# EAGLE schematic TakpadV3 (EAGLE 8.4.0)
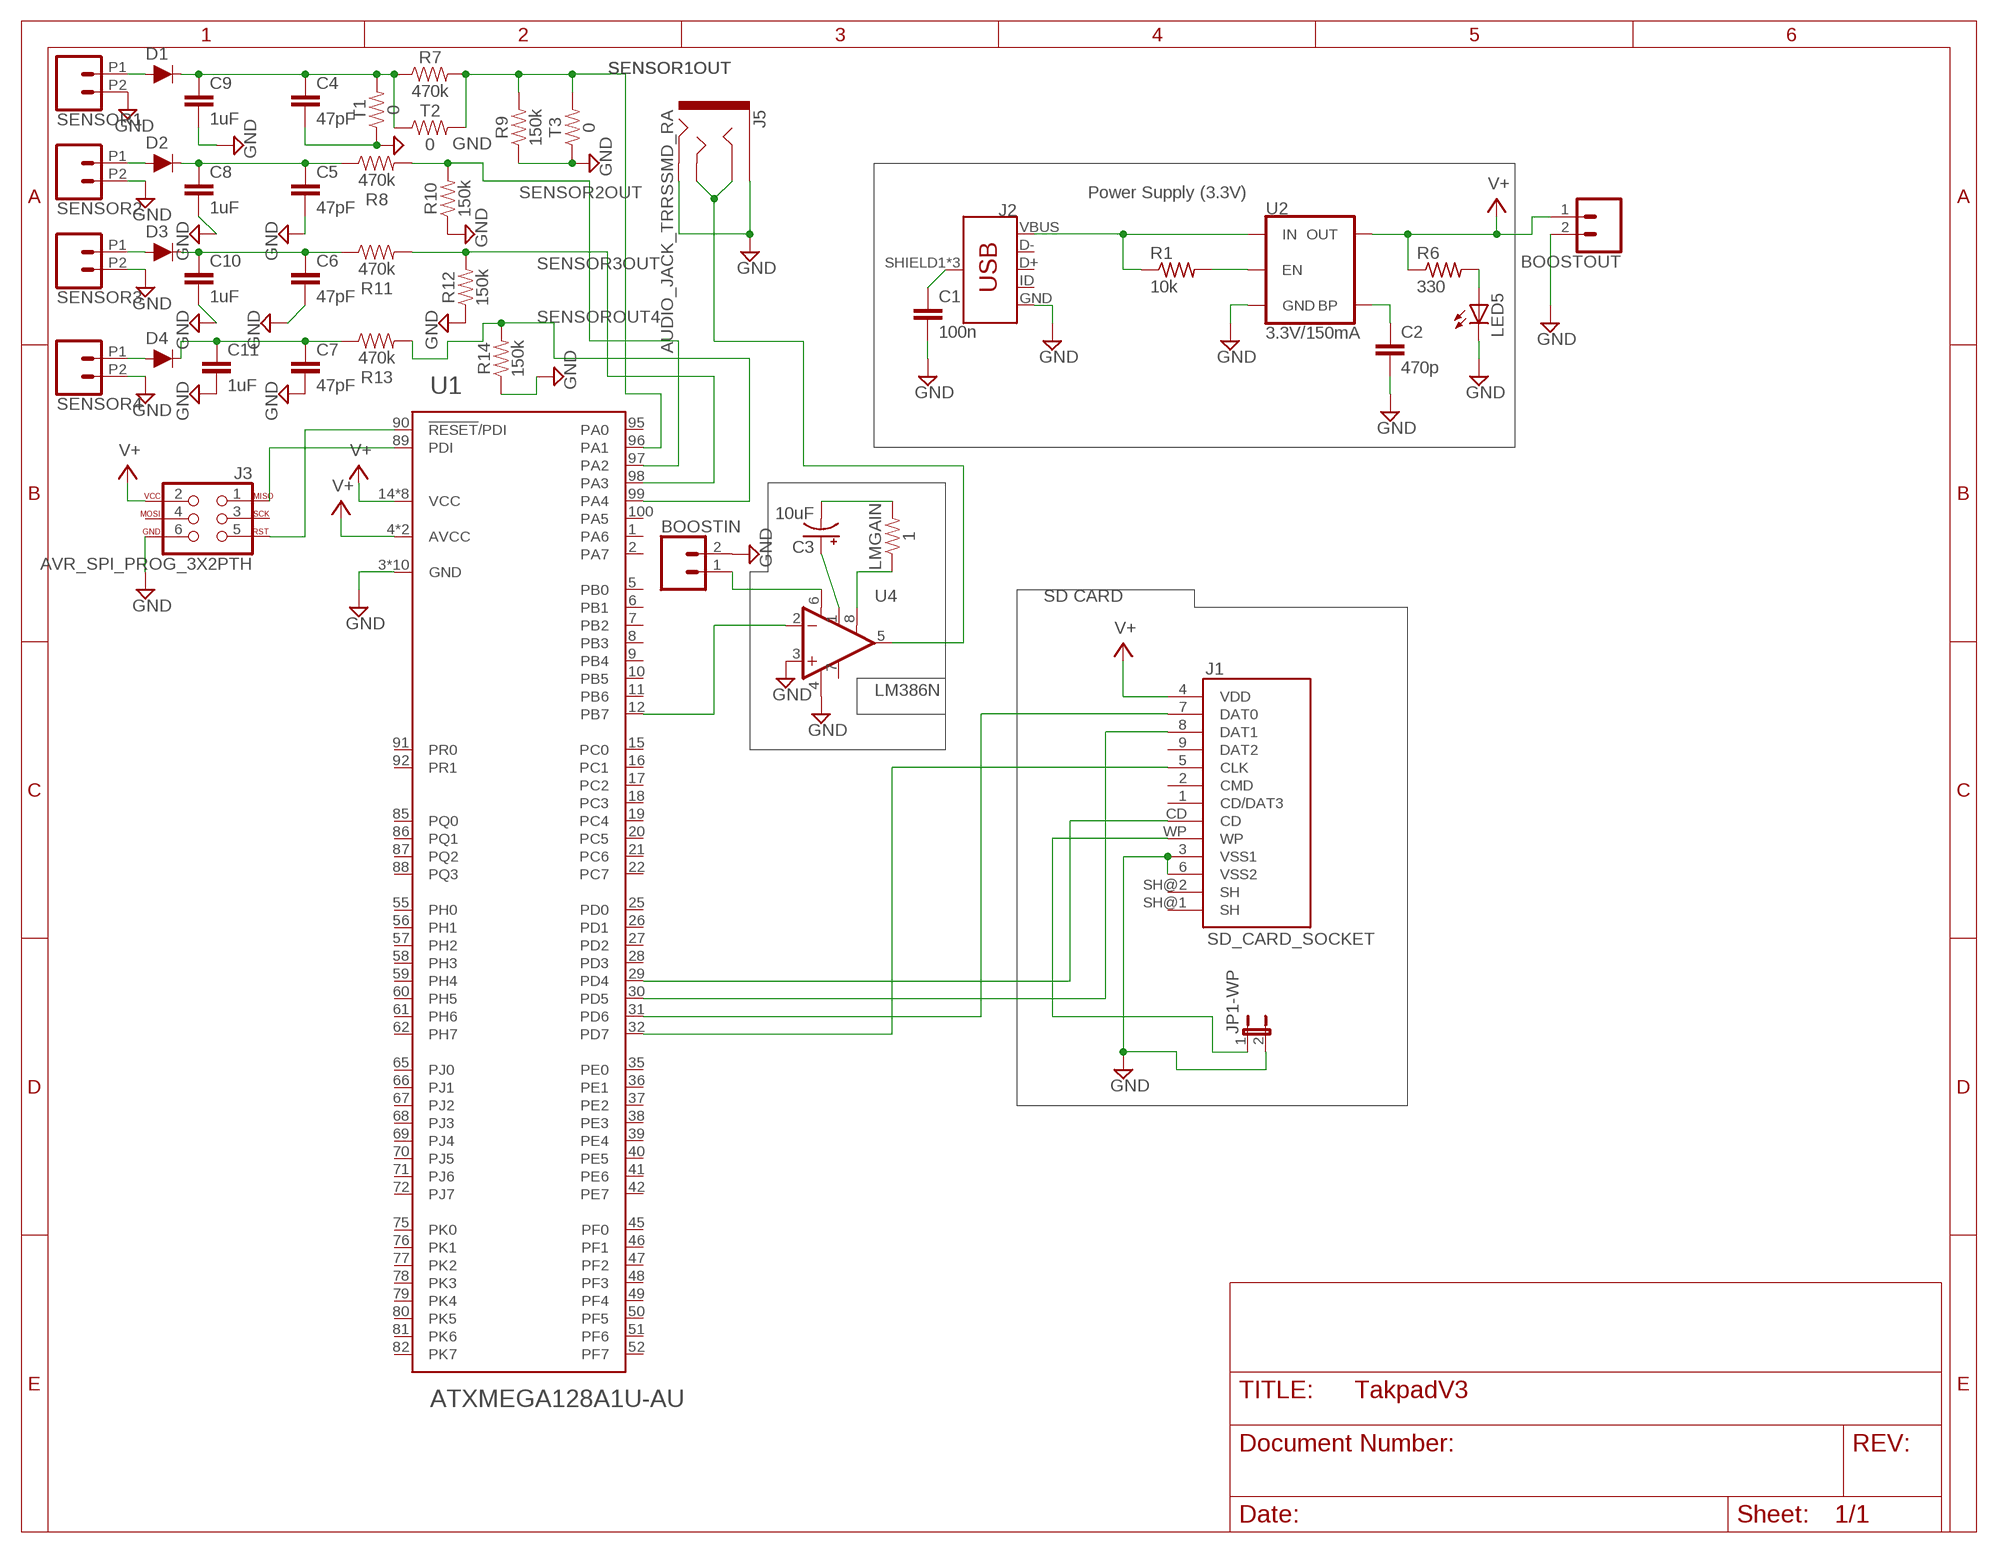
[diagram p0: schematic, sheet 1]

## Parts
BOOSTIN  CONN_02  [1X02]
BOOSTOUT  CONN_02  [1X02]
C1  100n  C-EUC1206  [C1206]
C2  470p  C-EUC1206  [C1206]
C3  10uF  10UF-POLAR-RADIAL-2.5MM-KIT-25V-20%  [CPOL-RADIAL-2.5MM-5MM-KIT]
C4  47pF  47PF-0603-50V-5%  [0603]
C5  47pF  47PF-0603-50V-5%  [0603]
C6  47pF  47PF-0603-50V-5%  [0603]
C7  47pF  47PF-0603-50V-5%  [0603]
C8  1uF  47PF-0603-50V-5%  [0603]
C9  1uF  47PF-0603-50V-5%  [0603]
C10  1uF  47PF-0603-50V-5%  [0603]
C11  1uF  47PF-0603-50V-5%  [0603]
D1  200mA/100V/1V  DIODE-1N4148  [DIODE-1N4148]
D2  200mA/100V/1V  DIODE-1N4148  [DIODE-1N4148]
D3  200mA/100V/1V  DIODE-1N4148  [DIODE-1N4148]
D4  200mA/100V/1V  DIODE-1N4148  [DIODE-1N4148]
J1  SD_CARD_SOCKET  [SD]
J2  USB_MICRO-B_FEMALE-SMT  [USB-B-MICRO-SMD]
J3  AVR_SPI_PROG_3X2PTH  [2X3]
J5  AUDIO_JACK_TRRSSMD_RA  [AUDIO_JACK_3.5MM_TRRS_SMD_RA]
JP1-WP  JUMPER-2PTH  [1X02]
LED5  LED10MM  [LED10MM]
LMGAIN  1  1OHM-0603-1/10W-1%  [0603]
R1  10k  R-US_M1206  [M1206]
R6  330  R-US_0204/7  [0204/7]
R7  470k  1KOHM-HORIZ-1/4W-1%  [AXIAL-0.3]
R8  470k  1KOHM-HORIZ-1/4W-1%  [AXIAL-0.3]
R9  150k  1KOHM-HORIZ-1/4W-1%  [AXIAL-0.3]
R10  150k  1KOHM-HORIZ-1/4W-1%  [AXIAL-0.3]
R11  470k  1KOHM-HORIZ-1/4W-1%  [AXIAL-0.3]
R12  150k  1KOHM-HORIZ-1/4W-1%  [AXIAL-0.3]
R13  470k  1KOHM-HORIZ-1/4W-1%  [AXIAL-0.3]
R14  150k  1KOHM-HORIZ-1/4W-1%  [AXIAL-0.3]
SENSOR1  CONN_022.54MM_SCREWTERM  [1X02_2.54_SCREWTERM]
SENSOR2  CONN_022.54MM_SCREWTERM  [1X02_2.54_SCREWTERM]
SENSOR3  CONN_022.54MM_SCREWTERM  [1X02_2.54_SCREWTERM]
SENSOR4  CONN_022.54MM_SCREWTERM  [1X02_2.54_SCREWTERM]
T1  0  1KOHM-HORIZ-1/4W-1%  [AXIAL-0.3]
T2  0  1KOHM-HORIZ-1/4W-1%  [AXIAL-0.3]
T3  0  1KOHM-HORIZ-1/4W-1%  [AXIAL-0.3]
U1  ATXMEGA128A1U-AU  [TQFP-100A-100]
U2  3.3V/150mA  V_REG_MIC52053.3V  [SOT23-5]
U4  LM386N  LM386  [DIP08]

## Nets
AUDIOINPUT: U1.12(PB7) U4.2(-IN)
AUDIOOUT: J5.RING1 J5.TIP U4.5(OUT)
BP: C2.1 U2.4(BP)
CD: J1.CD U1.29(PD4)
CLK: J1.5(CLK) U1.32(PD7)
DAT0: J1.7(DAT0) U1.31(PD6)
DAT1: J1.8(DAT1) U1.30(PD5)
EN: R1.2 U2.3(EN)
GND: BOOSTIN.2 BOOSTOUT.2 C1.2 C2.2 C4.2 C5.2 C6.2 C7.2 C8.2 C9.2 C10.2 C11.2 J1.3(VSS1) J1.6(VSS2) J2.GND J3.6 J5.EARTH J5.RING2 JP1-WP.2 LED5.K(C) R9.P$1 R10.P$1 R12.P$1 R14.P$1 SENSOR1.P2 SENSOR2.P2 SENSOR3.P2 SENSOR4.P2 T1.P$1 T3.P$1 U1.3(GND) U1.13(GND) U1.23(GND) U1.33(GND) U1.43(GND) U1.53(GND) U1.63(GND) U1.73(GND) U1.84(GND) U1.93(GND) U2.2(GND) U4.3(+IN) U4.4(V-)
LED: LED5.A R6.2
MISO: J3.1 U1.89(PDI)
N$9: C3.1(+) U4.1(GAIN)
N$10: C3.2(-) LMGAIN.2
N$11: LMGAIN.1 U4.8(GAIN)
RST: J3.5 U1.90(!RESET!/PDI)
SENSOR1: D1.A SENSOR1.P1
SENSOR1IN: C4.1 C9.1 D1.C R7.P$1 T1.P$2 T2.P$1
SENSOR1OUT: R7.P$2 R9.P$2 T2.P$2 T3.P$2 U1.96(PA1)
SENSOR2: D2.A SENSOR2.P1
SENSOR2IN: C5.1 C8.1 D2.C R8.P$1
SENSOR2OUT: R8.P$2 R10.P$2 U1.97(PA2)
SENSOR3: D3.A SENSOR3.P1
SENSOR3IN: C6.1 C10.1 D3.C R11.P$1
SENSOR3OUT: R11.P$2 R12.P$2 U1.98(PA3)
SENSOR4: D4.A SENSOR4.P1
SENSOR4IN: C7.1 C11.1 D4.C R13.P$1
SENSOROUT4: R13.P$2 R14.P$2 U1.99(PA4)
SHIELD: C1.1 J2.SHIELD1(SHIELD) J2.SHIELD2(SHIELD) J2.SHIELD3(SHIELD)
UPCONVERTERINPUT: BOOSTIN.1 U4.6(V+)
V+: BOOSTOUT.1 J1.4(VDD) J3.2 R6.1 U1.4(AVCC) U1.14(VCC) U1.24(VCC) U1.34(VCC) U1.44(VCC) U1.54(VCC) U1.64(VCC) U1.74(VCC) U1.83(VCC) U1.94(AVCC) U2.5(OUT)
VIN: J2.VBUS R1.1 U2.1(IN)
WP: J1.WP JP1-WP.1
Unconnected: J1.1(CD/DAT3) J1.2(CMD) J1.9(DAT2) J1.SH@1(SH) J1.SH@2(SH) J2.D+ J2.D- J2.ID J3.3 J3.4 U1.1(PA6) U1.2(PA7) U1.5(PB0) U1.6(PB1) U1.7(PB2) U1.8(PB3) U1.9(PB4) U1.10(PB5) U1.11(PB6) U1.15(PC0) U1.16(PC1) U1.17(PC2) U1.18(PC3) U1.19(PC4) U1.20(PC5) U1.21(PC6) U1.22(PC7) U1.25(PD0) U1.26(PD1) U1.27(PD2) U1.28(PD3) U1.35(PE0) U1.36(PE1) U1.37(PE2) U1.38(PE3) U1.39(PE4) U1.40(PE5) U1.41(PE6) U1.42(PE7) U1.45(PF0) U1.46(PF1) U1.47(PF2) U1.48(PF3) U1.49(PF4) U1.50(PF5) U1.51(PF6) U1.52(PF7) U1.55(PH0) U1.56(PH1) U1.57(PH2) U1.58(PH3) U1.59(PH4) U1.60(PH5) U1.61(PH6) U1.62(PH7) U1.65(PJ0) U1.66(PJ1) U1.67(PJ2) U1.68(PJ3) U1.69(PJ4) U1.70(PJ5) U1.71(PJ6) U1.72(PJ7) U1.75(PK0) U1.76(PK1) U1.77(PK2) U1.78(PK3) U1.79(PK4) U1.80(PK5) U1.81(PK6) U1.82(PK7) U1.85(PQ0) U1.86(PQ1) U1.87(PQ2) U1.88(PQ3) U1.91(PR0) U1.92(PR1) U1.95(PA0) U1.100(PA5) U4.7(BP)

## Notes on the sheet
- Power Supply (3.3V)
- SD CARD

## Library data of the parts
BOOSTIN BOOSTOUT SENSOR1-SENSOR4 = SparkFun-Connectors:CONN_02: Multi connection point. Often used as Generic Header-pin footprint for 0.1 inch spaced/style header connections On any of the 0.1 inch spaced packages, you can populate with these: Break Away Headers - Straight <https://www.sparkfun.com/products/116> (PRT-00116) Break Away Male Headers - Right Angle <https://www.sparkfun.com/products/553> (PRT-00553) Female Headers <https://www.sparkfun.com/products/115> (PRT-00115) Break Away Headers - Machine Pin <https://www.sparkfun.com/products/117> (PRT-00117) Break Away Female Headers - Swiss Machine Pin <https://www.sparkfun.com/products/743> (PRT-00743) For SCREWTERMINALS and SPRING TERMINALS visit here: Screw Terimnals on SparkFun.com <https://www.sparkfun.com/search/results?term=Screw+Terminals> (5mm/3.5mm/2.54mm spacing) This device is also useful as a general connection point to wire up your design to another part of your project. Our various solder wires solder well into these plated through hole pads. Hook-Up Wire - Assortment (Stranded, 22 AWG) <https://www.sparkfun.com/products/11375> (PRT-11375) Hook-Up Wire - Assortment (Solid Core, 22 AWG) <https://www.sparkfun.com/products/11367> (PRT-11367) View the entire wire category on our website here <https://www.sparkfun.com/categories/141> Special notes: Molex polarized connector foot print use with: PRT-08233 with associated crimp pins and housings. 2.54_SCREWTERM for use with PRT-10571. 3.5mm Screw Terminal footprints for PRT-08084 5mm Screw Terminal footprints for use with PRT-08432
C1 C2 = rcl:C-EU: CAPACITOR, European symbol
C3 = SparkFun-Capacitors:10UF-POLAR: 10.0µF polarized capacitors A capacitor is a passive two-terminal electrical component used to store electrical energy temporarily in an electric field.; PROD_ID: CAP-08440
C4-C7 = SparkFun-Capacitors:47PF: 47pF ceramic capacitors A capacitor is a passive two-terminal electrical component used to store electrical energy temporarily in an electric field.; PROD_ID: CAP-08913
C8-C11 = SparkFun-Capacitors:47PF: 47pF ceramic capacitors A capacitor is a passive two-terminal electrical component used to store electrical energy temporarily in an electric field.; PROD_ID: CAP-08913; VALUE: 47pF
D1-D4 = SparkFun-DiscreteSemi:DIODE: Diode These are standard reverse protection diodes and small signal diodes. SparkFun Products: SparkFun SparkPunk Sound Kit <https://www.sparkfun.com/products/11177> SparkFun ESP8266 Thing <https://www.sparkfun.com/products/13231>; PROD_ID: DIO-08378
J1 = SparkFun-Connectors:SD_CARD_SOCKET: SD Memory Card Connector (standard "large" size) Push-push normal type, CD enable, WP enable. Here is the connector we sell at SparkFun: SD/MMC Socket <https://www.sparkfun.com/products/12769> (PRT-12769) Datasheet <https://cdn.sparkfun.com/datasheets/Prototyping/19608.pdf> It is used on these SparkFun products: SparkFun SD/MMC Card Breakout <https://www.sparkfun.com/products/12941> (BOB-12941) SD Sniffer <https://www.sparkfun.com/products/11468> (TOL-11468); PROD_ID: CONN-11976; SF_ID: PRT-12769
J2 = SparkFun-Connectors:USB_MICRO-B: USB Type Micro-B Connector Male/female and PTH/SMT variants SparkFun Products: SparkFun microB USB Breakout <https://www.sparkfun.com/products/12035> SparkFun USB microB Plug Breakout <https://www.sparkfun.com/products/10031> SparkFun ESP8266 Thing <https://www.sparkfun.com/products/13231>; PROD_ID: CONN-11752
J3 = SparkFun-Connectors:AVR_SPI_PROG_3X2: AVR ISP 6 Pin This is the reduced ISP connector for AVR programming. Common on Arduino. This footprint will take up less PCB space and can be used with a 10-pin to 6-pin adapter such as SKU: BOB-08508 **Special note about "TEST_POINT" package. The stop mask is on the top side, so if you want your programming test points to be on the bottom of your board, make sure to place this package on the bottom side of the board. This also ensure that the orientation to program from the bottom side will be correct. SparkFun Products: SparkFun ISP Pogo Adapter <https://www.sparkfun.com/products/11591> - NS Tiny AVR Programmer <https://www.sparkfun.com/products/11801> -PTH
J5 = SparkFun-Connectors:AUDIO_JACK_TRRS: Audio Jack - 3.5mm TRRS (SMD) This is a 3.5mm TRRS SMD audio jack. TRRS connectors are the audio-style connectors that you see on some phones, MP3 players and development boards. TRRS stands for “tip, ring, ring, sleeve,” which reflects that this has three conductors and a ground. SparkFun Products: Audio Jack <https://www.sparkfun.com/products/12639> mbed Starter Kit <https://www.sparkfun.com/products/12968> SparkFun TRRS 3.5mm Jack Breakout <https://www.sparkfun.com/products/11570>; PROD_ID: CONN-10676; SF_ID: PRT-12639; SPICEPREFIX: E
JP1-WP = SparkFun-Retired:JUMPER-2: Jumper Basic 0.1" spaced jumper. Use with breakaway headers.
LED5 = led:LED: LED OSRAM: - CHIPLED LG R971, LG N971, LY N971, LG Q971, LY Q971, LO R971, LY R971 LH N974, LH R974 LS Q976, LO Q976, LY Q976 LO Q996 - Hyper CHIPLED LW Q18S LB Q993, LB Q99A, LB R99A - SideLED LS A670, LO A670, LY A670, LG A670, LP A670 LB A673, LV A673, LT A673, LW A673 LH A674 LY A675 LS A676, LA A676, LO A676, LY A676, LW A676 LS A679, LY A679, LG A679 - Hyper Micro SIDELED® LS Y876, LA Y876, LO Y876, LY Y876 LT Y87S - SmartLED LW L88C, LW L88S LB L89C, LB L89S, LG L890 LS L89K, LO L89K, LY L89K LS L896, LA L896, LO L896, LY L896 - TOPLED LS T670, LO T670, LY T670, LG T670, LP T670 LSG T670, LSP T670, LSY T670, LOP T670, LYG T670 LG T671, LOG T671, LSG T671 LB T673, LV T673, LT T673, LW T673 LH T674 LS T676, LA T676, LO T676, LY T676, LB T676, LH T676, LSB T676, LW T676 LB T67C, LV T67C, LT T67C, LS T67K, LO T67K, LY T67K, LW E67C LS E67B, LA E67B, LO E67B, LY E67B, LB E67C, LV E67C, LT E67C LW T67C LS T679, LY T679, LG T679 LS T770, LO T770, LY T770, LG T770, LP T770 LB T773, LV T773, LT T773, LW T773 LH T774 LS E675, LA E675, LY E675, LS T675 LS T776, LA T776, LO T776, LY T776, LB T776 LHGB T686 LT T68C, LB T68C - Hyper Mini TOPLED® LB M676 - Mini TOPLED Santana® LG M470 LS M47K, LO M47K, LY M47K Source: http://www.osram.convergy.de LUXEON: - LUMILED® LXK2-PW12-R00, LXK2-PW12-S00, LXK2-PW14-U00, LXK2-PW14-V00 LXK2-PM12-R00, LXK2-PM12-S00, LXK2-PM14-U00 LXK2-PE12-Q00, LXK2-PE12-R00, LXK2-PE12-S00, LXK2-PE14-T00, LXK2-PE14-U00 LXK2-PB12-K00, LXK2-PB12-L00, LXK2-PB12-M00, LXK2-PB14-N00, LXK2-PB14-P00, LXK2-PB14-Q00 LXK2-PR12-L00, LXK2-PR12-M00, LXK2-PR14-Q00, LXK2-PR14-R00 LXK2-PD12-Q00, LXK2-PD12-R00, LXK2-PD12-S00 LXK2-PH12-R00, LXK2-PH12-S00 LXK2-PL12-P00, LXK2-PL12-Q00, LXK2-PL12-R00 Source: www.luxeon.com KINGBRIGHT: KA-3528ASYC Source: www.kingbright.com
LMGAIN = SparkFun-Resistors:1OHM: 1Ω resistor A resistor is a passive two-terminal electrical component that implements electrical resistance as a circuit element. Resistors act to reduce current flow, and, at the same time, act to lower voltage levels within circuits. - Wikipedia; PROD_ID: RES-08269
R1 R6 = rcl:R-US_: RESISTOR, American symbol
R7-R14 T1-T3 = SparkFun-Resistors:1KOHM: 1kΩ resistor A resistor is a passive two-terminal electrical component that implements electrical resistance as a circuit element. Resistors act to reduce current flow, and, at the same time, act to lower voltage levels within circuits. - Wikipedia; PROD_ID: RES-12182; VALUE: 1k
U1 = atmel-xmega:ATXMEGA128A1U: 8/16-bit XMEGA A1U Microcontroller Features High-performance, low-power Atmel® AVR® XMEGA® 8/16-bit Microcontroller Nonvolatileprogram and data memories – 64K - 128KBytes of in-system self-programmable flash – 4K - 8KBytes boot section – 2KBytes EEPROM – 4K - 8KBytes internal SRAM External bus interface for up to 16Mbytes SRAM External bus interface for up to 128Mbit SDRAM Peripheral features – Four-channel DMA controller – Eight-channel event system – Eight 16-bit timer/counters Four timer/counters with 4 output compare or input capture channels Four timer/counters with 2 output compare or input capture channels High resolution extension on all timer/counters Advanced waveform extension (AWeX) on two timer/counters – One USB device interface USB 2.0 full speed (12Mbps) and low speed (1.5Mbps) device compliant 32 Endpoints with full configuration flexibility – Eight USARTs with IrDA support for one USART – Four two-wire interfaces with dual address match (I2C and SMBus compatible) – Four serial peripheral interfaces (SPIs) – AES and DES crypto engine – CRC-16 (CRC-CCITT) and CRC-32 (IEEE® 802.3) generator – 16-bit real time counter (RTC) with separate oscillator – Two sixteen channel, 12-bit, 2msps Analog to Digital Converters – Two Two-channel, 12-bit, 1msps Digital to Analog Converters – Four Analog Comparators (ACs) with window compare function, and current sources – External interrupts on all general purpose I/O pins – Programmable watchdog timer with separate on-chip ultra low power oscillator – QTouch® library support Capacitive touch buttons, sliders and wheels Special microcontroller features – Power-on reset and programmable brown-out detection – Internal and external clock options with PLL and prescaler – Programmable multilevel interrupt controller – Five sleep modes – Programming and debug interfaces JTAG (IEEE 1149.1 compliant) interface, including boundary scan PDI (Program and Debug Interface) I/O and packages – 78 Programmable I/O pins – 100 lead TQFP – 100 ball BGA – 100 ball VFBGA Operating voltage – 1.6 – 3.6V Operating frequency – 0 – 12MHz from 1.6V – 0 – 32MHz from 2.7V
U2 = SparkFun-IC-Power:V_REG_MIC5205: V_REG MIC5205 Standard 3.3V, 5V, and Adjustable 150mA LDO voltage regulator in SOT-23 layout. Micrel part MIC5205. BP (by-pass) pin is used to lower output noise with 470pF cap, may be left open. On the adjustable version BP is used to set output.; PROD_ID: VREG-00822
U4 = SparkFun-IC-Amplifiers:LM386: low voltage audio power amplifier SparkFun Products FabFM Radio Kit <https://www.sparkfun.com/products/11043> (KIT-11043); PROD_ID: IC-10899